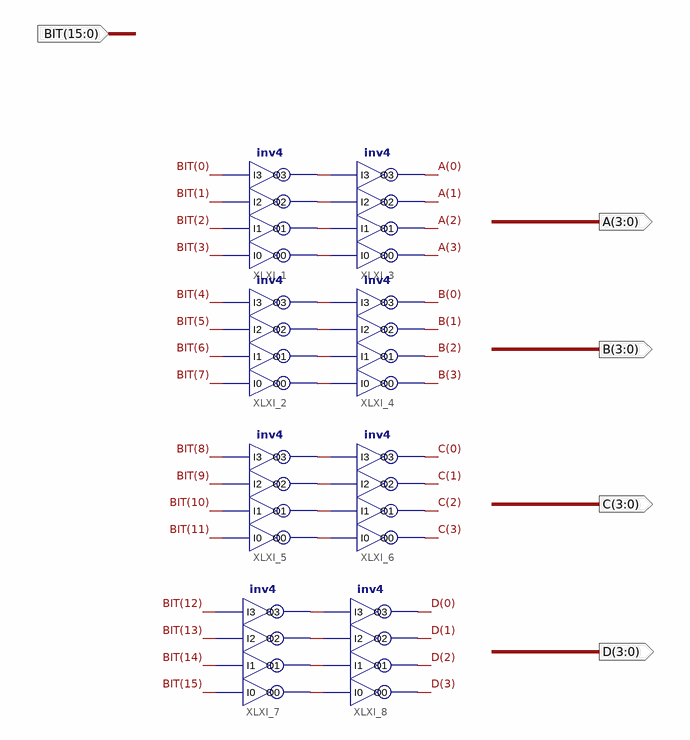
[diagram p0: schematic sheet 1]
// Xilinx ISE schematic MixBus16_4.sch (spartan6) as structural Verilog: 8 symbols, 5 ports
module MixBus16_4 (
  input  [15:0] BIT,
  output [3:0] D,
  output [3:0] C,
  output [3:0] B,
  output [3:0] A
);

  wire XLXN_1, XLXN_2, XLXN_3, XLXN_4, XLXN_5, XLXN_6, XLXN_7, XLXN_8, XLXN_25, XLXN_26, XLXN_27, XLXN_28,
       XLXN_29, XLXN_30, XLXN_31, XLXN_32;

  inv4 XLXI_1 (.I0(BIT[3]), .I1(BIT[2]), .I2(BIT[1]), .I3(BIT[0]), .O0(XLXN_1), .O1(XLXN_2), .O2(XLXN_3), .O3(XLXN_4));
  inv4 XLXI_2 (.I0(BIT[7]), .I1(BIT[6]), .I2(BIT[5]), .I3(BIT[4]), .O0(XLXN_5), .O1(XLXN_6), .O2(XLXN_7), .O3(XLXN_8));
  inv4 XLXI_3 (.I0(XLXN_1), .I1(XLXN_2), .I2(XLXN_3), .I3(XLXN_4), .O0(A[3]), .O1(A[2]), .O2(A[1]), .O3(A[0]));
  inv4 XLXI_4 (.I0(XLXN_5), .I1(XLXN_6), .I2(XLXN_7), .I3(XLXN_8), .O0(B[3]), .O1(B[2]), .O2(B[1]), .O3(B[0]));
  inv4 XLXI_5 (
    .I0(BIT[11]), .I1(BIT[10]), .I2(BIT[9]), .I3(BIT[8]), .O0(XLXN_28), .O1(XLXN_27), .O2(XLXN_26),
    .O3(XLXN_25));
  inv4 XLXI_6 (.I0(XLXN_28), .I1(XLXN_27), .I2(XLXN_26), .I3(XLXN_25), .O0(C[3]), .O1(C[2]), .O2(C[1]), .O3(C[0]));
  inv4 XLXI_7 (
    .I0(BIT[15]), .I1(BIT[14]), .I2(BIT[13]), .I3(BIT[12]), .O0(XLXN_32), .O1(XLXN_31), .O2(XLXN_30),
    .O3(XLXN_29));
  inv4 XLXI_8 (.I0(XLXN_32), .I1(XLXN_31), .I2(XLXN_30), .I3(XLXN_29), .O0(D[3]), .O1(D[2]), .O2(D[1]), .O3(D[0]));
endmodule
